# Altium schematic sheet LowFreqSignal.SchDoc: Low Freq Signal
size A4; DocumentNumber: 5; SheetNumber: 5; SheetTotal: 6
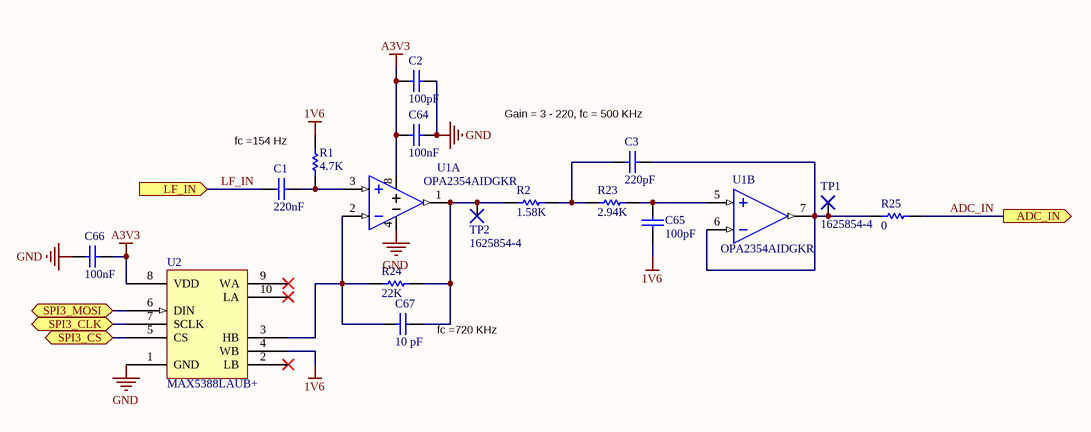
[diagram p0: LowFreqSignal.SchDoc]

## Parts
C1  220nF  [0603 Cap]
C2  100pF  [0603 Cap]
C3  220pF  [0603 Cap]
C64  100nF  [0603 Cap]
C65  100pF  [0603 Cap]
C66  100nF  [0603 Cap]
C67  10 pF  [CAPC1005X05L]
R1  4.7K  [0603 Res]
R2  1.58K  [0603 Res]
R23  2.94K  [0603 Res]
R24  22K  [0603 Res]
R25  0  [RESC1005X04L]
TP1  1625854-4  [TESTPOINT 1206]
TP2  1625854-4  [TESTPOINT 1206]
U1  OPA2354AIDGKR  [MSOP-8]  (parts A,B of 2)
U2  MAX5388LAUB+  [uSOP-10 uMAX]

## Ports
ADC_IN (out), LF_IN (in), SPI3_CLK (bidir), SPI3_CS (bidir), SPI3_MOSI (bidir)

## Nets
1V6: C65.1 R1.2 U2.4(WB)
A3V3: C2.1 C64.1 C66.2 U1.8(V+) U2.8(VDD)
GND: C2.2 C64.2 C66.1 U1.4(V-) U2.1(GND)
ADC_IN: R25.2 ; port ADC_IN
LF_IN: C1.1 ; port LF_IN
SPI3_CLK: U2.7(SCLK) ; port SPI3_CLK
SPI3_CS: U2.5(CS) ; port SPI3_CS
SPI3_MOSI: U2.6(DIN) ; port SPI3_MOSI
NetC1_2: C1.2 R1.1 U1.3(IN+A)
NetC3_1: C3.1 R25.1 TP1.1 U1.6(IN-B) U1.7(OUTB)
NetC3_2: C3.2 R2.2 R23.1
NetC65_2: C65.2 R23.2 U1.5(IN+B)
NetC67_1: C67.1 R24.1 U1.2(IN-A) U2.3(HB)
NetC67_2: C67.2 R2.1 R24.2 TP2.1 U1.1(OUTA)

Not connected (* = marked no-connect by the designer): U2 2(LB)* 9(WA)* 10(LA)*

## Notes on the sheet
- (near C3) Gain = 3 - 220, fc = 500 KHz
- fc =154 Hz
- (near C67) fc =720 KHz
- Title
- Size:
- A4
- Number:
- Revision:
- Date:
- Sheet
- of

## Library data of the parts
C1 = C1608X7R1C224K080AC: CAP CER 0.22UF 16V X7R 0603; Manufacturer: TDK Corporation; Capacitance: 0.22µF; Tolerance: ±10%; Supplier 1: Digi-Key; Manufacturer Part Number: C1608X7R1C224K080AC; RoHS: RoHS Compliant; Category: Capacitors; Stock 1: 523797; Pricing 1: 1=0.09, 10=0.056, 25=0.0408, 50=0.0304, 100=0.0249, 250=0.0208, 500=0.01776, 1000=0.01396 (EUR); Packaging: Digi-Reel®; Part Status: Active; Voltage - Rated: 16V; Temperature Coefficient: X7R; Operating Temperature: -55°C ~ 125°C; Features: Low ESL; Ratings: -; Applications: General Purpose; Failure Rate: -; Mounting Type: Surface Mount, MLCC; Package / Case: 0603 (1608 Metric); Size / Dimension: 0.063" L x 0.031" W (1.60mm x 0.80mm); Height - Seated (Max): -; Thickness (Max): 0.037" (0.95mm); Lead Spacing: -; Lead Style: -; ComponentLink1URL: https://product.tdk.com/info/en/catalog/datasheets/mlcc_commercial_general_en.pdf; ComponentLink1Description: https://product.tdk.com/info/en/catalog/datasheets/mlcc_commercial_general_en.pdf; Supplier Part Number 1: 445-1318-6-ND
C2 C65 = CL10B101KB8NNNC: CAP CER 100PF 50V X7R 0603; Manufacturer: Samsung Electro-Mechanics America, Inc.; Tolerance: ±10%; Supplier 1: Digi-Key; Manufacturer Part Number: CL10B101KB8NNNC; RoHS: RoHS Compliant; Category: Capacitors; Stock 1: 270807; Pricing 1: 1=0.08, 10=0.026, 100=0.0116, 500=0.00832, 1000=0.00653 (EUR); Packaging: Cut Tape (CT); Part Status: Active; Voltage - Rated: 50V; Temperature Coefficient: X7R; Operating Temperature: -55°C ~ 125°C; Features: -; Ratings: -; Applications: General Purpose; Mounting Type: Surface Mount, MLCC; Package / Case: 0603 (1608 Metric); Size / Dimension: 0.063" L x 0.032" W (1.60mm x 0.80mm); Height - Seated (Max): -; Thickness (Max): 0.035" (0.90mm); Lead Spacing: -; Lead Style: -; ComponentLink1URL: http://media.digikey.com/pdf/Data%20Sheets/Samsung%20PDFs/CL_Series_MLCC_ds.pdf; ComponentLink1Description: http://media.digikey.com/pdf/Data%20Sheets/Samsung%20PDFs/CL_Series_MLCC_ds.pdf; Supplier Part Number 1: 1276-1909-1-ND
C3 = CL10B221KB8WPNC: CAP CER 220PF 50V X7R 0603; Manufacturer: Samsung Electro-Mechanics America, Inc.; Tolerance: ±10%; Supplier 1: Digi-Key; Manufacturer Part Number: CL10B221KB8WPNC; RoHS: RoHS Compliant; Category: Capacitors; Stock 1: 28547; Pricing 1: 1=0.09, 10=0.027, 100=0.0123, 500=0.0088, 1000=0.00691 (EUR); Packaging: Cut Tape (CT); Part Status: Active; Voltage - Rated: 50V; Temperature Coefficient: X7R; Operating Temperature: -55°C ~ 125°C; Features: Open Mode, Soft Termination; Ratings: AEC-Q200; Applications: Automotive, Boardflex Sensitive; Mounting Type: Surface Mount, MLCC; Package / Case: 0603 (1608 Metric); Size / Dimension: 0.063" L x 0.031" W (1.60mm x 0.80mm); Height - Seated (Max): -; Thickness (Max): 0.035" (0.90mm); Lead Spacing: -; Lead Style: -; ComponentLink1URL: http://www.samsungsem.com/kr/support/library/product-catalog/mlcc.jsp; ComponentLink1Description: http://www.samsungsem.com/kr/support/library/product-catalog/mlcc.jsp; Supplier Part Number 1: 1276-6536-1-ND
C64 C66 = C0603C104K4RACTU: CAP CER 0.1UF 16V X7R 0603; Manufacturer: KEMET; Capacitance: 0.1µF; Tolerance: ±10%; Supplier 1: Digi-Key; Manufacturer Part Number: C0603C104K4RACTU; RoHS: RoHS Compliant; Category: Capacitors; Stock 1: 4491346; Pricing 1: 1=0.09, 10=0.022, 25=0.016, 50=0.0122, 100=0.01, 250=0.00836, 500=0.0071, 1000=0.00559 (EUR); Packaging: Digi-Reel®; Part Status: Active; Voltage - Rated: 16V; Temperature Coefficient: X7R; Operating Temperature: -55°C ~ 125°C; Features: -; Ratings: -; Applications: General Purpose; Failure Rate: -; Mounting Type: Surface Mount, MLCC; Package / Case: 0603 (1608 Metric); Size / Dimension: 0.063" L x 0.031" W (1.60mm x 0.80mm); Height - Seated (Max): -; Thickness (Max): 0.034" (0.87mm); Lead Spacing: -; Lead Style: -; ComponentLink1URL: http://www.kemet.com/docfinder?Partnumber=C0603C104K4RACTU; ComponentLink1Description: http://www.kemet.com/docfinder?Partnumber=C0603C104K4RACTU; Supplier Part Number 1: 399-1096-6-ND
C67 = CL05C100JB5NNNC: CAP CER 10PF 50V 5% NP0 0402; Manufacturer: Samsung Electro-Mechanics America, Inc; Temperature Coefficient: C0G, NP0; Supplier 1: Digi-Key; Supplier Part Number 1: 1276-1139-1-ND; Manufacturer Part Number: CL05C100JB5NNNC; RoHS: RoHS Compliant; Category: Capacitors; Stock 1: 376482; Pricing 1: 1=0.09, 10=0.011, 25=0.008, 100=0.0052, 500=0.00366, 1000=0.00285, 2500=0.00256, 5000=0.00238 (EUR); Packaging: Cut Tape (CT); Capacitance: 10pF; Tolerance: ±5%; Voltage - Rated: 50V; Mounting Type: Surface Mount, MLCC; Operating Temperature: -55°C ~ 125°C; Applications: General Purpose; Ratings: -; Package / Case: 0402 (1005 Metric); Size / Dimension: 0.039" L x 0.020" W (1.00mm x 0.50mm); Height - Seated (Max): -; Thickness (Max): 0.022" (0.55mm); Lead Spacing: -; Features: -; Lead Style: -; ComponentLink1URL: http://www.samsungsem.com/servlet/FileDownload?type=spec&file=CL05C100JB5NNNC.pdf; ComponentLink1Description: http://www.samsungsem.com/servlet/FileDownload?type=spec&file=CL05C100JB5NNNC.pdf
R1 = RC0603FR-074K7L: RES SMD 4.7K OHM 1% 1/10W 0603; Manufacturer: Yageo; Power (Watts): 0.1W, 1/10W; Temperature Coefficient: ±100ppm/°C; Supplier 1: Digi-Key; Manufacturer Part Number: RC0603FR-074K7L; RoHS: RoHS Compliant; Category: Resistors; Stock 1: 4164276; Pricing 1: 1=0.08, 10=0.012, 100=0.005, 1000=0.00222, 2500=0.00193 (EUR); Packaging: Cut Tape (CT); Part Status: Active; Tolerance: ±1%; Composition: Thick Film; Features: Moisture Resistant; Operating Temperature: -55°C ~ 155°C; Package / Case: 0603 (1608 Metric); Supplier Device Package: 0603; Size / Dimension: 0.063" L x 0.032" W (1.60mm x 0.80mm); Height - Seated (Max): 0.022" (0.55mm); Failure Rate: -; ComponentLink1URL: http://www.yageo.com/documents/recent/PYu-RC_Group_51_RoHS_L_7.pdf; ComponentLink1Description: http://www.yageo.com/documents/recent/PYu-RC_Group_51_RoHS_L_7.pdf; Supplier Part Number 1: 311-4.70KHRCT-ND
R2 = RC0603FR-071K58L: RES SMD 1.58K OHM 1% 1/10W 0603; Manufacturer: Yageo; Power (Watts): 0.1W, 1/10W; Temperature Coefficient: ±100ppm/°C; Supplier 1: Digi-Key; Manufacturer Part Number: RC0603FR-071K58L; RoHS: RoHS Compliant; Category: Resistors; Stock 1: 225833; Pricing 1: 1=0.08, 10=0.012, 100=0.005, 1000=0.00222, 2500=0.00193 (EUR); Packaging: Cut Tape (CT); Part Status: Active; Tolerance: ±1%; Composition: Thick Film; Features: Moisture Resistant; Operating Temperature: -55°C ~ 155°C; Package / Case: 0603 (1608 Metric); Supplier Device Package: 0603; Size / Dimension: 0.063" L x 0.032" W (1.60mm x 0.80mm); Height - Seated (Max): 0.022" (0.55mm); Failure Rate: -; ComponentLink1URL: http://www.yageo.com/documents/recent/PYu-RC_Group_51_RoHS_L_7.pdf; ComponentLink1Description: http://www.yageo.com/documents/recent/PYu-RC_Group_51_RoHS_L_7.pdf; Supplier Part Number 1: 311-1.58KHRCT-ND
R23 = RC0603FR-072K94L: RES SMD 2.94K OHM 1% 1/10W 0603; Manufacturer: Yageo; Power (Watts): 0.1W, 1/10W; Temperature Coefficient: ±100ppm/°C; Supplier 1: Digi-Key; Manufacturer Part Number: RC0603FR-072K94L; RoHS: RoHS Compliant; Category: Resistors; Stock 1: 178896; Pricing 1: 1=0.08, 10=0.012, 100=0.005, 1000=0.00222, 2500=0.00193 (EUR); Packaging: Cut Tape (CT); Part Status: Active; Tolerance: ±1%; Composition: Thick Film; Features: Moisture Resistant; Operating Temperature: -55°C ~ 155°C; Package / Case: 0603 (1608 Metric); Supplier Device Package: 0603; Size / Dimension: 0.063" L x 0.032" W (1.60mm x 0.80mm); Height - Seated (Max): 0.022" (0.55mm); Failure Rate: -; ComponentLink1URL: http://www.yageo.com/documents/recent/PYu-RC_Group_51_RoHS_L_7.pdf; ComponentLink1Description: http://www.yageo.com/documents/recent/PYu-RC_Group_51_RoHS_L_7.pdf; Supplier Part Number 1: 311-2.94KHRCT-ND
R24 = RC0603FR-0722KL: RES SMD 22K OHM 1% 1/10W 0603; Manufacturer: Yageo; Power (Watts): 0.1W, 1/10W; Temperature Coefficient: ±100ppm/°C; Supplier 1: Digi-Key; Manufacturer Part Number: RC0603FR-0722KL; RoHS: RoHS Compliant; Category: Resistors; Stock 1: 1960774; Pricing 1: 1=0.09, 10=0.012, 25=0.0088, 50=0.0066, 100=0.0049, 250=0.00372, 500=0.00296, 1000=0.00218 (EUR); Packaging: Cut Tape (CT); Part Status: Active; Resistance (Ohms): 22k; Tolerance: ±1%; Composition: Thick Film; Features: Moisture Resistant; Operating Temperature: -55°C ~ 155°C; Package / Case: 0603 (1608 Metric); Supplier Device Package: 0603; Size / Dimension: 0.063" L x 0.031" W (1.60mm x 0.80mm); Height - Seated (Max): 0.022" (0.55mm); Failure Rate: -; ComponentLink1URL: http://www.yageo.com/documents/recent/PYu-RC_Group_51_RoHS_L_7.pdf; ComponentLink1Description: http://www.yageo.com/documents/recent/PYu-RC_Group_51_RoHS_L_7.pdf; Supplier Part Number 1: 311-22.0KHRCT-ND
R25 = RC1005J000CS: RES 0.0 OHM 1/16W JUMP 0402; Manufacturer: Samsung Electro-Mechanics America, Inc; Resistance (Ohms): 0.0; Tolerance: Jumper; Power (Watts): 0.063W, 1/16W; Supplier 1: Digi-Key; Supplier Part Number 1: 1276-3480-1-ND; Manufacturer Part Number: RC1005J000CS; RoHS: RoHS Compliant; Category: Resistors; Stock 1: 2874816; Pricing 1: 1=0.09, 10=0.01, 25=0.0072, 100=0.0039, 500=0.00238, 1000=0.00174, 2500=0.00151, 5000=0.00125 (EUR); Packaging: Cut Tape (CT); Composition: Thick Film; Features: -; Temperature Coefficient: -; Operating Temperature: -55°C ~ 155°C; Package / Case: 0402 (1005 Metric); Supplier Device Package: 0402 (1005 Metric); Size / Dimension: 0.039" L x 0.020" W (1.00mm x 0.50mm); Height: 0.016" (0.40mm); Number of Terminations: 2; ComponentLink1URL: http://www.samsungsem.com/servlet/FileDownload?filename=productcatalog/pdf/Chip_Resistor.pdf; ComponentLink1Description: http://www.samsungsem.com/servlet/FileDownload?filename=productcatalog/pdf/Chip_Resistor.pdf
TP1 TP2 = 1625854-4: 1206 PROBE PAD; Manufacturer: TE Connectivity AMP Connectors; Brand: TE Connectivity / Holsworthy; Supplier 1: Digi-Key; Manufacturer Part Number: 1625854-4; RoHS: RoHS Compliant; Category: Test and Measurement; Stock 1: 5106; Pricing 1: 1=0.19, 25=0.1696, 50=0.1516, 100=0.1338, 250=0.11776, 500=0.1008 (EUR); Packaging: Cut Tape (CT); Type: PC Test Point; Terminal: 0.126" x 0.063" x 0.079" (3.20mm x 1.60mm x 2.00mm); Mounting Type: Surface Mount; Material: -; Color: Natural; ComponentLink1URL: http://www.te.com/commerce/DocumentDelivery/DDEController?Action=srchrtrv&DocNm=1773266&DocType=DS&DocLang=English; ComponentLink1Description: http://www.te.com/commerce/DocumentDelivery/DDEController?Action=srchrtrv&DocNm=1773266&DocType=DS&DocLang=English; Supplier 2: Mouser; Stock 2: 0; Pricing 2: 1=0.202, 25=0.182, 50=0.163, 100=0.144, 250=0.127, 500=0.108, 2000=0.108 (EUR); Package/Case: 1206 (3216 metric); Series: RC; Termination Style: SMD/SMT; Case Code - in: 1206; Case Code - mm: 3216; Standard Pack Qty: 2000; RoHS - Mouser: Y; Minimum Order Quantity: 1; Reeling: True; ComponentLink2URL: http://www.mouser.com/ds/2/418/NG_DS_1773266_A-732548.pdf; ComponentLink2Description: http://www.mouser.com/ds/2/418/NG_DS_1773266_A-732548.pdf; Supplier Part Number 1: A106146CT-ND; Supplier Part Number 2: 279-RCW-0C
U1 = OPA2354AIDGKR: IC OPAMP VFB 100MHZ RRO 8VSSOP; Manufacturer: Texas Instruments; Amplifier Type: Voltage Feedback; Output Type: Rail-to-Rail; Slew Rate: 150 V/µs; -3db Bandwidth: 250MHz; Current - Supply: 4.9mA; Voltage - Supply, Single/Dual (±): 2.5 V ~ 5.5 V, ±1.25 V ~ 2.75 V; Supplier 1: Digi-Key; Manufacturer Part Number: OPA2354AIDGKR; RoHS: RoHS Compliant; Category: Integrated Circuits (ICs); Stock 1: 5751; Pricing 1: 1=2.24, 10=2.013, 100=1.6494, 500=1.4041, 1000=1.18418 (EUR); Packaging: Cut Tape (CT); Part Status: Active; Operating Temperature: -40°C ~ 125°C; Mounting Type: Surface Mount; Package / Case: 8-TSSOP, 8-MSOP (0.118", 3.00mm Width); Supplier Device Package: 8-VSSOP; ComponentLink1URL: http://www.ti.com/lit/ds/symlink/opa354.pdf; ComponentLink1Description: http://www.ti.com/lit/ds/symlink/opa354.pdf; Supplier Part Number 1: 296-12642-1-ND
U2 = MAX5388LAUB+: IC DGTL POT 256POS 10K 10UMAX; Manufacturer: Maxim Integrated; Configuration: Potentiometer, Rheostat; Number of Taps: 256; Interface: SPI; Memory Type: Volatile; Voltage - Supply: 2.6 V ~ 5.5 V; Tolerance: ±25%; Temperature Coefficient (Typ): 35 ppm/°C; Resistance - Wiper (Ohms) (Typ): 250; Supplier 1: Digi-Key; Manufacturer Part Number: MAX5388LAUB+; RoHS: RoHS Compliant; Category: Integrated Circuits (ICs); Stock 1: 396; Pricing 1: 1=1.09, 10=1.053, 50=1.0366 (EUR); Packaging: Tube; Part Status: Active; Taper: Linear; Resistance (Ohms): 10k; Features: -; Operating Temperature: -40°C ~ 125°C; Package / Case: 10-TFSOP, 10-MSOP (0.118", 3.00mm Width); Supplier Device Package: 10-uMAX; ComponentLink1URL: https://datasheets.maximintegrated.com/en/ds/MAX5386-MAX5388.pdf; ComponentLink1Description: https://datasheets.maximintegrated.com/en/ds/MAX5386-MAX5388.pdf; Supplier Part Number 1: MAX5388LAUB+-ND